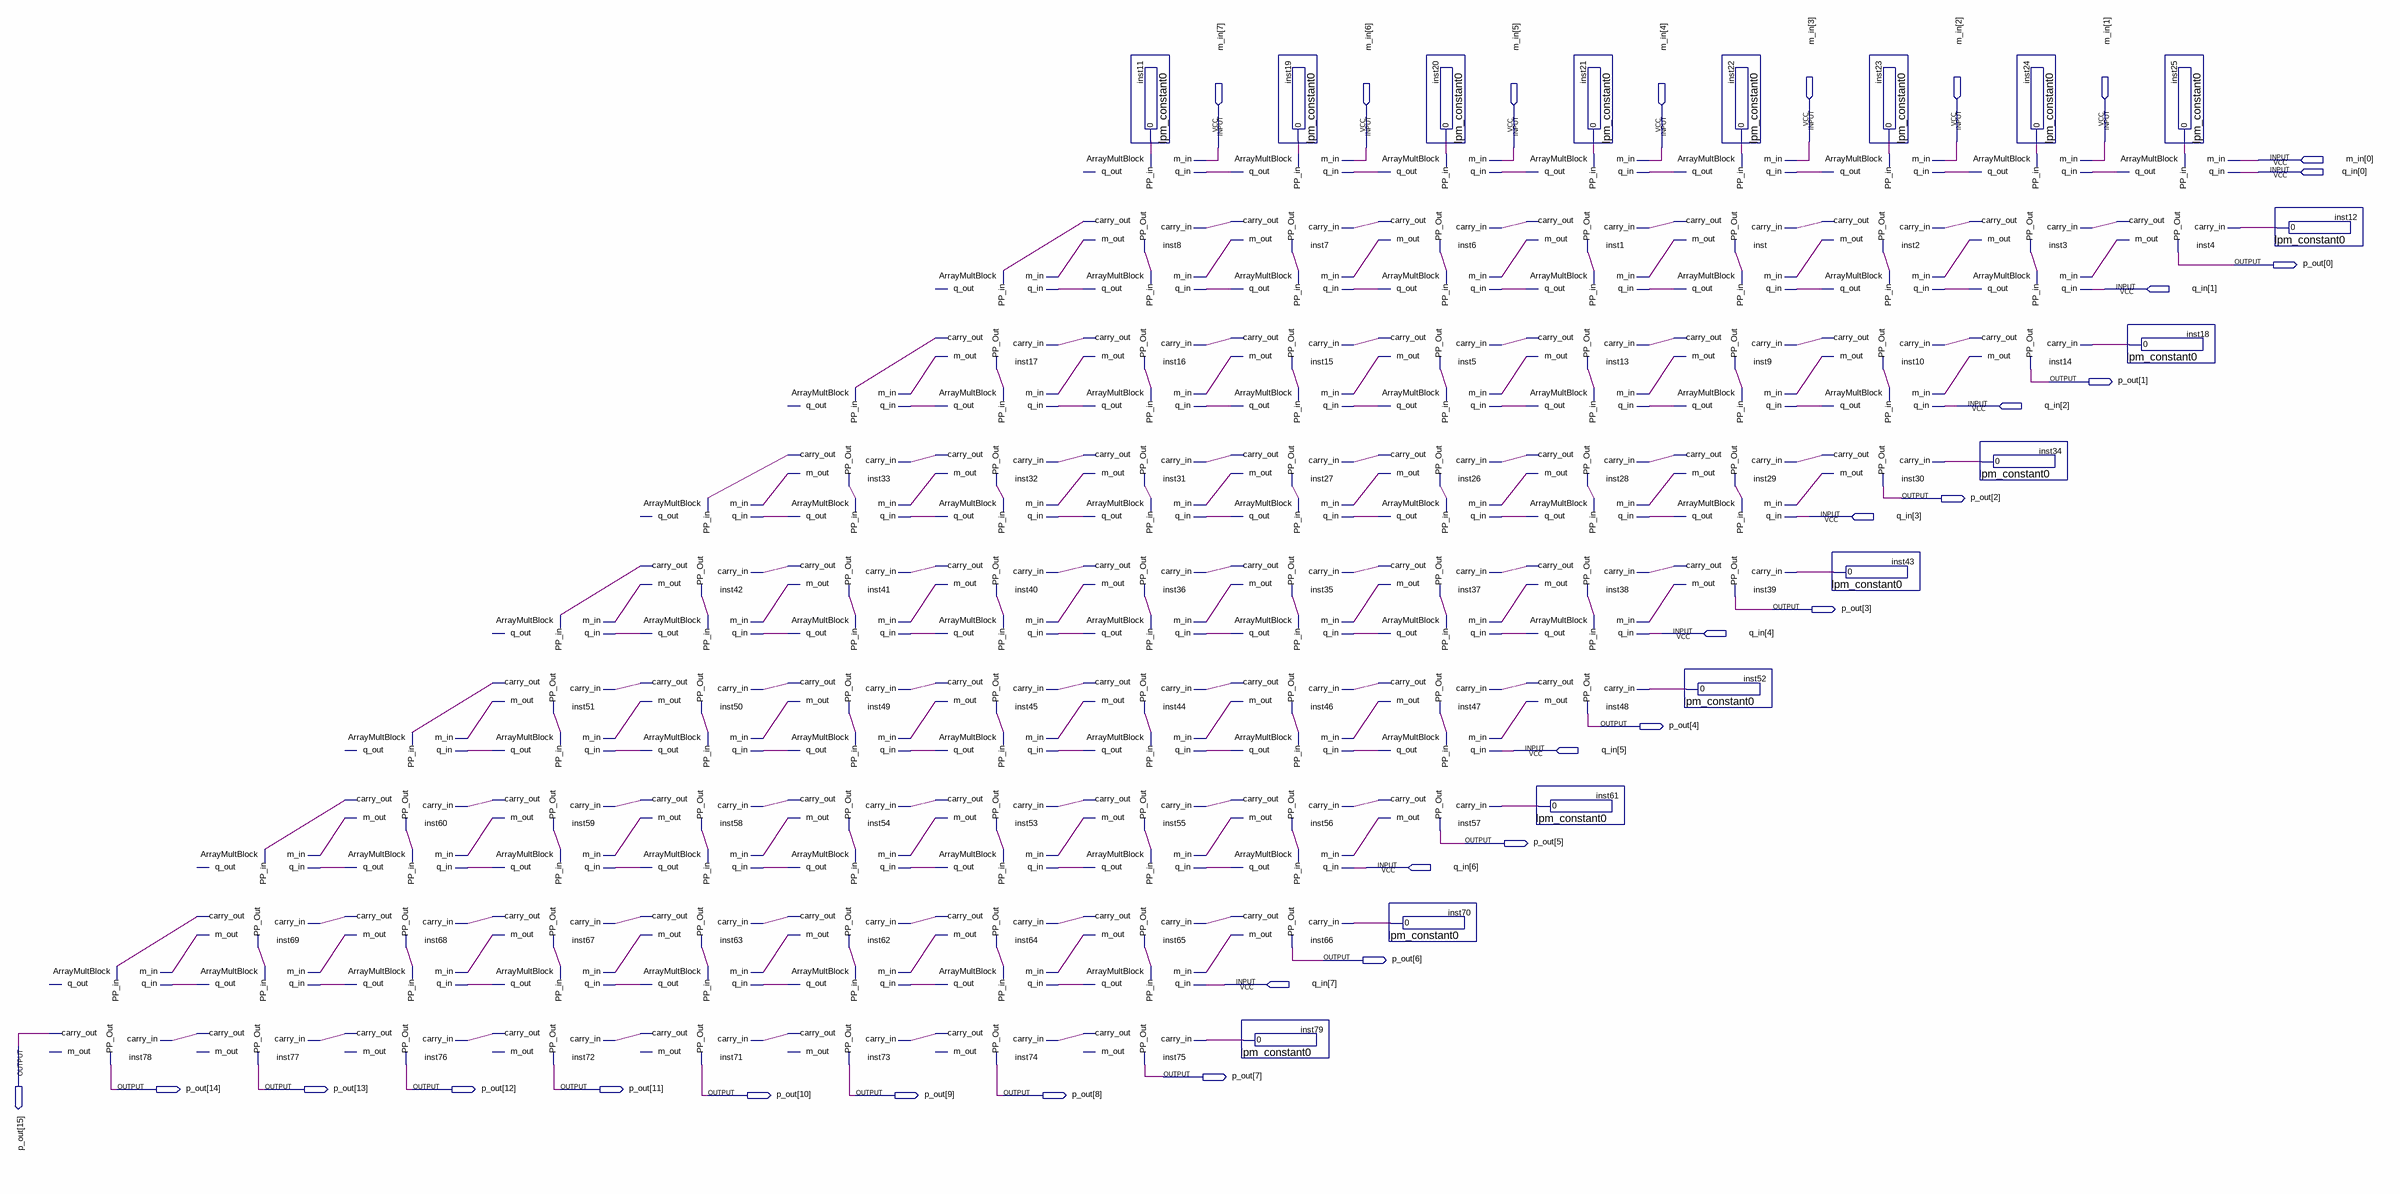
[diagram p0: schematic sheet]
// Quartus schematic arr_bit_mult.bdf as structural Verilog: 80 symbols, 32 pins
module arr_bit_mult (
  input  [7:0] m_in,
  input  [7:0] q_in,
  output [15:0] p_out
);

  wire inst1_carry_out, inst1_m_out, inst1_pp_out, inst1_q_out, inst2_carry_out, inst2_m_out, inst2_pp_out,
       inst2_q_out, inst3_carry_out, inst3_m_out, inst3_pp_out, inst3_q_out, inst4_carry_out, inst4_m_out,
       inst4_q_out, inst5_carry_out, inst5_m_out, inst5_pp_out, inst5_q_out, inst6_carry_out, inst6_m_out,
       inst6_pp_out, inst6_q_out, inst7_carry_out, inst7_m_out, inst7_pp_out, inst7_q_out, inst8_carry_out,
       inst8_m_out, inst8_pp_out, inst9_carry_out, inst9_m_out, inst9_pp_out, inst9_q_out, inst10_carry_out,
       inst10_m_out, inst10_pp_out, inst10_q_out, inst11_result, inst12_result, inst13_carry_out,
       inst13_m_out, inst13_pp_out, inst13_q_out, inst14_carry_out, inst14_m_out, inst14_q_out,
       inst15_carry_out, inst15_m_out, inst15_pp_out, inst15_q_out, inst16_carry_out, inst16_m_out,
       inst16_pp_out, inst16_q_out, inst17_carry_out, inst17_m_out, inst17_pp_out, inst18_result,
       inst19_result, inst20_result, inst21_result, inst22_result, inst23_result, inst24_result,
       inst25_result, inst26_carry_out, inst26_m_out, inst26_pp_out, inst26_q_out, inst27_carry_out,
       inst27_m_out, inst27_pp_out, inst27_q_out, inst28_carry_out, inst28_m_out, inst28_pp_out,
       inst28_q_out, inst29_carry_out, inst29_m_out, inst29_pp_out, inst29_q_out, inst30_carry_out,
       inst30_m_out, inst30_q_out, inst31_carry_out, inst31_m_out, inst31_pp_out, inst31_q_out,
       inst32_carry_out, inst32_m_out, inst32_pp_out, inst32_q_out, inst33_carry_out, inst33_m_out,
       inst33_pp_out, inst34_result, inst35_carry_out, inst35_m_out, inst35_pp_out, inst35_q_out,
       inst36_carry_out, inst36_m_out, inst36_pp_out, inst36_q_out, inst37_carry_out, inst37_m_out,
       inst37_pp_out, inst37_q_out, inst38_carry_out, inst38_m_out, inst38_pp_out, inst38_q_out,
       inst39_carry_out, inst39_m_out, inst39_q_out, inst40_carry_out, inst40_m_out, inst40_pp_out,
       inst40_q_out, inst41_carry_out, inst41_m_out, inst41_pp_out, inst41_q_out, inst42_carry_out,
       inst42_m_out, inst42_pp_out, inst43_result, inst44_carry_out, inst44_m_out, inst44_pp_out,
       inst44_q_out, inst45_carry_out, inst45_m_out, inst45_pp_out, inst45_q_out, inst46_carry_out,
       inst46_m_out, inst46_pp_out, inst46_q_out, inst47_carry_out, inst47_m_out, inst47_pp_out,
       inst47_q_out, inst48_carry_out, inst48_m_out, inst48_q_out, inst49_carry_out, inst49_m_out,
       inst49_pp_out, inst49_q_out, inst50_carry_out, inst50_m_out, inst50_pp_out, inst50_q_out,
       inst51_carry_out, inst51_m_out, inst51_pp_out, inst52_result, inst53_carry_out, inst53_m_out,
       inst53_pp_out, inst53_q_out, inst54_carry_out, inst54_m_out, inst54_pp_out, inst54_q_out,
       inst55_carry_out, inst55_m_out, inst55_pp_out, inst55_q_out, inst56_carry_out, inst56_m_out,
       inst56_pp_out, inst56_q_out, inst57_carry_out, inst57_m_out, inst57_q_out, inst58_carry_out,
       inst58_m_out, inst58_pp_out, inst58_q_out, inst59_carry_out, inst59_m_out, inst59_pp_out,
       inst59_q_out, inst60_carry_out, inst60_m_out, inst60_pp_out, inst61_result, inst62_carry_out,
       inst62_m_out, inst62_pp_out, inst62_q_out, inst63_carry_out, inst63_m_out, inst63_pp_out,
       inst63_q_out, inst64_carry_out, inst64_m_out, inst64_pp_out, inst64_q_out, inst65_carry_out,
       inst65_m_out, inst65_pp_out, inst65_q_out, inst66_carry_out, inst66_m_out, inst66_q_out,
       inst67_carry_out, inst67_m_out, inst67_pp_out, inst67_q_out, inst68_carry_out, inst68_m_out,
       inst68_pp_out, inst68_q_out, inst69_carry_out, inst69_m_out, inst69_pp_out, inst70_result,
       inst71_carry_out, inst71_q_out, inst72_carry_out, inst72_q_out, inst73_carry_out, inst73_q_out,
       inst74_carry_out, inst74_q_out, inst75_carry_out, inst75_q_out, inst76_carry_out, inst76_q_out,
       inst77_carry_out, inst77_q_out, inst79_result, inst_carry_out, inst_m_out, inst_pp_out, inst_q_out;

  ArrayMultBlock inst78 (
    .PP_in(inst69_carry_out), .q_in(inst77_q_out), .m_in(inst69_m_out), .carry_in(inst77_carry_out),
    .carry_out(p_out[15]), .PP_Out(p_out[14]));  // open: q_out, m_out
  ArrayMultBlock inst69 (
    .PP_in(inst60_carry_out), .q_in(inst68_q_out), .m_in(inst60_m_out), .carry_in(inst68_carry_out),
    .carry_out(inst69_carry_out), .m_out(inst69_m_out), .PP_Out(inst69_pp_out));  // open: q_out
  ArrayMultBlock inst77 (
    .PP_in(inst69_pp_out), .q_in(inst76_q_out), .m_in(inst68_m_out), .carry_in(inst76_carry_out),
    .q_out(inst77_q_out), .carry_out(inst77_carry_out), .PP_Out(p_out[13]));  // open: m_out
  ArrayMultBlock inst60 (
    .PP_in(inst51_carry_out), .q_in(inst59_q_out), .m_in(inst51_m_out), .carry_in(inst59_carry_out),
    .carry_out(inst60_carry_out), .m_out(inst60_m_out), .PP_Out(inst60_pp_out));  // open: q_out
  ArrayMultBlock inst68 (
    .PP_in(inst60_pp_out), .q_in(inst67_q_out), .m_in(inst59_m_out), .carry_in(inst67_carry_out),
    .q_out(inst68_q_out), .carry_out(inst68_carry_out), .m_out(inst68_m_out), .PP_Out(inst68_pp_out));
  ArrayMultBlock inst76 (
    .PP_in(inst68_pp_out), .q_in(inst72_q_out), .m_in(inst67_m_out), .carry_in(inst72_carry_out),
    .q_out(inst76_q_out), .carry_out(inst76_carry_out), .PP_Out(p_out[12]));  // open: m_out
  ArrayMultBlock inst51 (
    .PP_in(inst42_carry_out), .q_in(inst50_q_out), .m_in(inst42_m_out), .carry_in(inst50_carry_out),
    .carry_out(inst51_carry_out), .m_out(inst51_m_out), .PP_Out(inst51_pp_out));  // open: q_out
  ArrayMultBlock inst59 (
    .PP_in(inst51_pp_out), .q_in(inst58_q_out), .m_in(inst50_m_out), .carry_in(inst58_carry_out),
    .q_out(inst59_q_out), .carry_out(inst59_carry_out), .m_out(inst59_m_out), .PP_Out(inst59_pp_out));
  ArrayMultBlock inst67 (
    .PP_in(inst59_pp_out), .q_in(inst63_q_out), .m_in(inst58_m_out), .carry_in(inst63_carry_out),
    .q_out(inst67_q_out), .carry_out(inst67_carry_out), .m_out(inst67_m_out), .PP_Out(inst67_pp_out));
  ArrayMultBlock inst72 (
    .PP_in(inst67_pp_out), .q_in(inst71_q_out), .m_in(inst63_m_out), .carry_in(inst71_carry_out),
    .q_out(inst72_q_out), .carry_out(inst72_carry_out), .PP_Out(p_out[11]));  // open: m_out
  ArrayMultBlock inst42 (
    .PP_in(inst33_carry_out), .q_in(inst41_q_out), .m_in(inst33_m_out), .carry_in(inst41_carry_out),
    .carry_out(inst42_carry_out), .m_out(inst42_m_out), .PP_Out(inst42_pp_out));  // open: q_out
  ArrayMultBlock inst50 (
    .PP_in(inst42_pp_out), .q_in(inst49_q_out), .m_in(inst41_m_out), .carry_in(inst49_carry_out),
    .q_out(inst50_q_out), .carry_out(inst50_carry_out), .m_out(inst50_m_out), .PP_Out(inst50_pp_out));
  ArrayMultBlock inst58 (
    .PP_in(inst50_pp_out), .q_in(inst54_q_out), .m_in(inst49_m_out), .carry_in(inst54_carry_out),
    .q_out(inst58_q_out), .carry_out(inst58_carry_out), .m_out(inst58_m_out), .PP_Out(inst58_pp_out));
  ArrayMultBlock inst63 (
    .PP_in(inst58_pp_out), .q_in(inst62_q_out), .m_in(inst54_m_out), .carry_in(inst62_carry_out),
    .q_out(inst63_q_out), .carry_out(inst63_carry_out), .m_out(inst63_m_out), .PP_Out(inst63_pp_out));
  ArrayMultBlock inst71 (
    .PP_in(inst63_pp_out), .q_in(inst73_q_out), .m_in(inst62_m_out), .carry_in(inst73_carry_out),
    .q_out(inst71_q_out), .carry_out(inst71_carry_out), .PP_Out(p_out[10]));  // open: m_out
  ArrayMultBlock inst33 (
    .PP_in(inst17_carry_out), .q_in(inst32_q_out), .m_in(inst17_m_out), .carry_in(inst32_carry_out),
    .carry_out(inst33_carry_out), .m_out(inst33_m_out), .PP_Out(inst33_pp_out));  // open: q_out
  ArrayMultBlock inst41 (
    .PP_in(inst33_pp_out), .q_in(inst40_q_out), .m_in(inst32_m_out), .carry_in(inst40_carry_out),
    .q_out(inst41_q_out), .carry_out(inst41_carry_out), .m_out(inst41_m_out), .PP_Out(inst41_pp_out));
  ArrayMultBlock inst49 (
    .PP_in(inst41_pp_out), .q_in(inst45_q_out), .m_in(inst40_m_out), .carry_in(inst45_carry_out),
    .q_out(inst49_q_out), .carry_out(inst49_carry_out), .m_out(inst49_m_out), .PP_Out(inst49_pp_out));
  ArrayMultBlock inst54 (
    .PP_in(inst49_pp_out), .q_in(inst53_q_out), .m_in(inst45_m_out), .carry_in(inst53_carry_out),
    .q_out(inst54_q_out), .carry_out(inst54_carry_out), .m_out(inst54_m_out), .PP_Out(inst54_pp_out));
  ArrayMultBlock inst62 (
    .PP_in(inst54_pp_out), .q_in(inst64_q_out), .m_in(inst53_m_out), .carry_in(inst64_carry_out),
    .q_out(inst62_q_out), .carry_out(inst62_carry_out), .m_out(inst62_m_out), .PP_Out(inst62_pp_out));
  ArrayMultBlock inst73 (
    .PP_in(inst62_pp_out), .q_in(inst74_q_out), .m_in(inst64_m_out), .carry_in(inst74_carry_out),
    .q_out(inst73_q_out), .carry_out(inst73_carry_out), .PP_Out(p_out[9]));  // open: m_out
  ArrayMultBlock inst17 (
    .PP_in(inst8_carry_out), .q_in(inst16_q_out), .m_in(inst8_m_out), .carry_in(inst16_carry_out),
    .carry_out(inst17_carry_out), .m_out(inst17_m_out), .PP_Out(inst17_pp_out));  // open: q_out
  ArrayMultBlock inst32 (
    .PP_in(inst17_pp_out), .q_in(inst31_q_out), .m_in(inst16_m_out), .carry_in(inst31_carry_out),
    .q_out(inst32_q_out), .carry_out(inst32_carry_out), .m_out(inst32_m_out), .PP_Out(inst32_pp_out));
  ArrayMultBlock inst40 (
    .PP_in(inst32_pp_out), .q_in(inst36_q_out), .m_in(inst31_m_out), .carry_in(inst36_carry_out),
    .q_out(inst40_q_out), .carry_out(inst40_carry_out), .m_out(inst40_m_out), .PP_Out(inst40_pp_out));
  ArrayMultBlock inst45 (
    .PP_in(inst40_pp_out), .q_in(inst44_q_out), .m_in(inst36_m_out), .carry_in(inst44_carry_out),
    .q_out(inst45_q_out), .carry_out(inst45_carry_out), .m_out(inst45_m_out), .PP_Out(inst45_pp_out));
  ArrayMultBlock inst53 (
    .PP_in(inst45_pp_out), .q_in(inst55_q_out), .m_in(inst44_m_out), .carry_in(inst55_carry_out),
    .q_out(inst53_q_out), .carry_out(inst53_carry_out), .m_out(inst53_m_out), .PP_Out(inst53_pp_out));
  ArrayMultBlock inst64 (
    .PP_in(inst53_pp_out), .q_in(inst65_q_out), .m_in(inst55_m_out), .carry_in(inst65_carry_out),
    .q_out(inst64_q_out), .carry_out(inst64_carry_out), .m_out(inst64_m_out), .PP_Out(inst64_pp_out));
  ArrayMultBlock inst74 (
    .PP_in(inst64_pp_out), .q_in(inst75_q_out), .m_in(inst65_m_out), .carry_in(inst75_carry_out),
    .q_out(inst74_q_out), .carry_out(inst74_carry_out), .PP_Out(p_out[8]));  // open: m_out
  ArrayMultBlock inst8 (
    .PP_in(inst11_result), .q_in(inst7_q_out), .m_in(m_in[7]), .carry_in(inst7_carry_out),
    .carry_out(inst8_carry_out), .m_out(inst8_m_out), .PP_Out(inst8_pp_out));  // open: q_out
  ArrayMultBlock inst16 (
    .PP_in(inst8_pp_out), .q_in(inst15_q_out), .m_in(inst7_m_out), .carry_in(inst15_carry_out),
    .q_out(inst16_q_out), .carry_out(inst16_carry_out), .m_out(inst16_m_out), .PP_Out(inst16_pp_out));
  ArrayMultBlock inst31 (
    .PP_in(inst16_pp_out), .q_in(inst27_q_out), .m_in(inst15_m_out), .carry_in(inst27_carry_out),
    .q_out(inst31_q_out), .carry_out(inst31_carry_out), .m_out(inst31_m_out), .PP_Out(inst31_pp_out));
  ArrayMultBlock inst36 (
    .PP_in(inst31_pp_out), .q_in(inst35_q_out), .m_in(inst27_m_out), .carry_in(inst35_carry_out),
    .q_out(inst36_q_out), .carry_out(inst36_carry_out), .m_out(inst36_m_out), .PP_Out(inst36_pp_out));
  ArrayMultBlock inst44 (
    .PP_in(inst36_pp_out), .q_in(inst46_q_out), .m_in(inst35_m_out), .carry_in(inst46_carry_out),
    .q_out(inst44_q_out), .carry_out(inst44_carry_out), .m_out(inst44_m_out), .PP_Out(inst44_pp_out));
  ArrayMultBlock inst55 (
    .PP_in(inst44_pp_out), .q_in(inst56_q_out), .m_in(inst46_m_out), .carry_in(inst56_carry_out),
    .q_out(inst55_q_out), .carry_out(inst55_carry_out), .m_out(inst55_m_out), .PP_Out(inst55_pp_out));
  ArrayMultBlock inst65 (
    .PP_in(inst55_pp_out), .q_in(inst66_q_out), .m_in(inst56_m_out), .carry_in(inst66_carry_out),
    .q_out(inst65_q_out), .carry_out(inst65_carry_out), .m_out(inst65_m_out), .PP_Out(inst65_pp_out));
  ArrayMultBlock inst75 (
    .PP_in(inst65_pp_out), .q_in(q_in[7]), .m_in(inst66_m_out), .carry_in(inst79_result),
    .q_out(inst75_q_out), .carry_out(inst75_carry_out), .PP_Out(p_out[7]));  // open: m_out
  lpm_constant0 inst11 (.result(inst11_result));
  ArrayMultBlock inst7 (
    .PP_in(inst19_result), .q_in(inst6_q_out), .m_in(m_in[6]), .carry_in(inst6_carry_out),
    .q_out(inst7_q_out), .carry_out(inst7_carry_out), .m_out(inst7_m_out), .PP_Out(inst7_pp_out));
  ArrayMultBlock inst15 (
    .PP_in(inst7_pp_out), .q_in(inst5_q_out), .m_in(inst6_m_out), .carry_in(inst5_carry_out),
    .q_out(inst15_q_out), .carry_out(inst15_carry_out), .m_out(inst15_m_out), .PP_Out(inst15_pp_out));
  ArrayMultBlock inst27 (
    .PP_in(inst15_pp_out), .q_in(inst26_q_out), .m_in(inst5_m_out), .carry_in(inst26_carry_out),
    .q_out(inst27_q_out), .carry_out(inst27_carry_out), .m_out(inst27_m_out), .PP_Out(inst27_pp_out));
  ArrayMultBlock inst35 (
    .PP_in(inst27_pp_out), .q_in(inst37_q_out), .m_in(inst26_m_out), .carry_in(inst37_carry_out),
    .q_out(inst35_q_out), .carry_out(inst35_carry_out), .m_out(inst35_m_out), .PP_Out(inst35_pp_out));
  ArrayMultBlock inst46 (
    .PP_in(inst35_pp_out), .q_in(inst47_q_out), .m_in(inst37_m_out), .carry_in(inst47_carry_out),
    .q_out(inst46_q_out), .carry_out(inst46_carry_out), .m_out(inst46_m_out), .PP_Out(inst46_pp_out));
  ArrayMultBlock inst56 (
    .PP_in(inst46_pp_out), .q_in(inst57_q_out), .m_in(inst47_m_out), .carry_in(inst57_carry_out),
    .q_out(inst56_q_out), .carry_out(inst56_carry_out), .m_out(inst56_m_out), .PP_Out(inst56_pp_out));
  ArrayMultBlock inst66 (
    .PP_in(inst56_pp_out), .q_in(q_in[6]), .m_in(inst57_m_out), .carry_in(inst70_result),
    .q_out(inst66_q_out), .carry_out(inst66_carry_out), .m_out(inst66_m_out), .PP_Out(p_out[6]));
  lpm_constant0 inst79 (.result(inst79_result));
  lpm_constant0 inst19 (.result(inst19_result));
  ArrayMultBlock inst6 (
    .PP_in(inst20_result), .q_in(inst1_q_out), .m_in(m_in[5]), .carry_in(inst1_carry_out),
    .q_out(inst6_q_out), .carry_out(inst6_carry_out), .m_out(inst6_m_out), .PP_Out(inst6_pp_out));
  ArrayMultBlock inst5 (
    .PP_in(inst6_pp_out), .q_in(inst13_q_out), .m_in(inst1_m_out), .carry_in(inst13_carry_out),
    .q_out(inst5_q_out), .carry_out(inst5_carry_out), .m_out(inst5_m_out), .PP_Out(inst5_pp_out));
  ArrayMultBlock inst26 (
    .PP_in(inst5_pp_out), .q_in(inst28_q_out), .m_in(inst13_m_out), .carry_in(inst28_carry_out),
    .q_out(inst26_q_out), .carry_out(inst26_carry_out), .m_out(inst26_m_out), .PP_Out(inst26_pp_out));
  ArrayMultBlock inst37 (
    .PP_in(inst26_pp_out), .q_in(inst38_q_out), .m_in(inst28_m_out), .carry_in(inst38_carry_out),
    .q_out(inst37_q_out), .carry_out(inst37_carry_out), .m_out(inst37_m_out), .PP_Out(inst37_pp_out));
  ArrayMultBlock inst47 (
    .PP_in(inst37_pp_out), .q_in(inst48_q_out), .m_in(inst38_m_out), .carry_in(inst48_carry_out),
    .q_out(inst47_q_out), .carry_out(inst47_carry_out), .m_out(inst47_m_out), .PP_Out(inst47_pp_out));
  ArrayMultBlock inst57 (
    .PP_in(inst47_pp_out), .q_in(q_in[5]), .m_in(inst48_m_out), .carry_in(inst61_result),
    .q_out(inst57_q_out), .carry_out(inst57_carry_out), .m_out(inst57_m_out), .PP_Out(p_out[5]));
  lpm_constant0 inst70 (.result(inst70_result));
  lpm_constant0 inst20 (.result(inst20_result));
  ArrayMultBlock inst1 (
    .PP_in(inst21_result), .q_in(inst_q_out), .m_in(m_in[4]), .carry_in(inst_carry_out), .q_out(inst1_q_out),
    .carry_out(inst1_carry_out), .m_out(inst1_m_out), .PP_Out(inst1_pp_out));
  ArrayMultBlock inst13 (
    .PP_in(inst1_pp_out), .q_in(inst9_q_out), .m_in(inst_m_out), .carry_in(inst9_carry_out),
    .q_out(inst13_q_out), .carry_out(inst13_carry_out), .m_out(inst13_m_out), .PP_Out(inst13_pp_out));
  ArrayMultBlock inst28 (
    .PP_in(inst13_pp_out), .q_in(inst29_q_out), .m_in(inst9_m_out), .carry_in(inst29_carry_out),
    .q_out(inst28_q_out), .carry_out(inst28_carry_out), .m_out(inst28_m_out), .PP_Out(inst28_pp_out));
  ArrayMultBlock inst38 (
    .PP_in(inst28_pp_out), .q_in(inst39_q_out), .m_in(inst29_m_out), .carry_in(inst39_carry_out),
    .q_out(inst38_q_out), .carry_out(inst38_carry_out), .m_out(inst38_m_out), .PP_Out(inst38_pp_out));
  ArrayMultBlock inst48 (
    .PP_in(inst38_pp_out), .q_in(q_in[4]), .m_in(inst39_m_out), .carry_in(inst52_result),
    .q_out(inst48_q_out), .carry_out(inst48_carry_out), .m_out(inst48_m_out), .PP_Out(p_out[4]));
  lpm_constant0 inst61 (.result(inst61_result));
  lpm_constant0 inst21 (.result(inst21_result));
  ArrayMultBlock inst (
    .PP_in(inst22_result), .q_in(inst2_q_out), .m_in(m_in[3]), .carry_in(inst2_carry_out),
    .q_out(inst_q_out), .carry_out(inst_carry_out), .m_out(inst_m_out), .PP_Out(inst_pp_out));
  ArrayMultBlock inst9 (
    .PP_in(inst_pp_out), .q_in(inst10_q_out), .m_in(inst2_m_out), .carry_in(inst10_carry_out),
    .q_out(inst9_q_out), .carry_out(inst9_carry_out), .m_out(inst9_m_out), .PP_Out(inst9_pp_out));
  ArrayMultBlock inst29 (
    .PP_in(inst9_pp_out), .q_in(inst30_q_out), .m_in(inst10_m_out), .carry_in(inst30_carry_out),
    .q_out(inst29_q_out), .carry_out(inst29_carry_out), .m_out(inst29_m_out), .PP_Out(inst29_pp_out));
  ArrayMultBlock inst39 (
    .PP_in(inst29_pp_out), .q_in(q_in[3]), .m_in(inst30_m_out), .carry_in(inst43_result),
    .q_out(inst39_q_out), .carry_out(inst39_carry_out), .m_out(inst39_m_out), .PP_Out(p_out[3]));
  lpm_constant0 inst52 (.result(inst52_result));
  lpm_constant0 inst22 (.result(inst22_result));
  ArrayMultBlock inst2 (
    .PP_in(inst23_result), .q_in(inst3_q_out), .m_in(m_in[2]), .carry_in(inst3_carry_out),
    .q_out(inst2_q_out), .carry_out(inst2_carry_out), .m_out(inst2_m_out), .PP_Out(inst2_pp_out));
  ArrayMultBlock inst10 (
    .PP_in(inst2_pp_out), .q_in(inst14_q_out), .m_in(inst3_m_out), .carry_in(inst14_carry_out),
    .q_out(inst10_q_out), .carry_out(inst10_carry_out), .m_out(inst10_m_out), .PP_Out(inst10_pp_out));
  ArrayMultBlock inst30 (
    .PP_in(inst10_pp_out), .q_in(q_in[2]), .m_in(inst14_m_out), .carry_in(inst34_result),
    .q_out(inst30_q_out), .carry_out(inst30_carry_out), .m_out(inst30_m_out), .PP_Out(p_out[2]));
  lpm_constant0 inst43 (.result(inst43_result));
  lpm_constant0 inst23 (.result(inst23_result));
  ArrayMultBlock inst3 (
    .PP_in(inst24_result), .q_in(inst4_q_out), .m_in(m_in[1]), .carry_in(inst4_carry_out),
    .q_out(inst3_q_out), .carry_out(inst3_carry_out), .m_out(inst3_m_out), .PP_Out(inst3_pp_out));
  ArrayMultBlock inst14 (
    .PP_in(inst3_pp_out), .q_in(q_in[1]), .m_in(inst4_m_out), .carry_in(inst18_result), .q_out(inst14_q_out),
    .carry_out(inst14_carry_out), .m_out(inst14_m_out), .PP_Out(p_out[1]));
  lpm_constant0 inst34 (.result(inst34_result));
  lpm_constant0 inst24 (.result(inst24_result));
  ArrayMultBlock inst4 (
    .PP_in(inst25_result), .q_in(q_in[0]), .m_in(m_in[0]), .carry_in(inst12_result), .q_out(inst4_q_out),
    .carry_out(inst4_carry_out), .m_out(inst4_m_out), .PP_Out(p_out[0]));
  lpm_constant0 inst18 (.result(inst18_result));
  lpm_constant0 inst25 (.result(inst25_result));
  lpm_constant0 inst12 (.result(inst12_result));
endmodule
